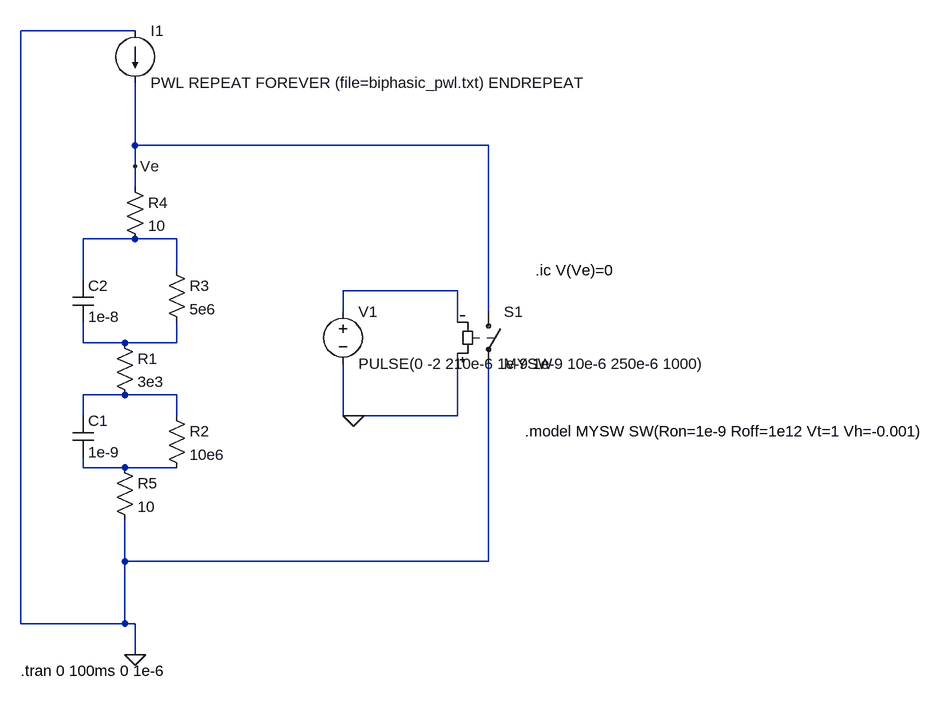
[diagram p0: schematic biphasic_triphasic_shorting.asc]
biphasic_triphasic_shorting.asc, the LTspice schematic file:
Version 4
SHEET 1 1400 680
WIRE 176 -480 0 -480
WIRE 176 -304 176 -400
WIRE 720 -304 176 -304
WIRE 176 -272 176 -304
WIRE 176 -240 176 -272
WIRE 176 -160 96 -160
WIRE 240 -160 176 -160
WIRE 240 -112 240 -160
WIRE 96 -96 96 -160
WIRE 672 -80 496 -80
WIRE 496 -48 496 -80
WIRE 720 -48 720 -304
WIRE 672 -32 672 -80
WIRE 96 0 96 -32
WIRE 160 0 96 0
WIRE 240 0 240 -32
WIRE 240 0 160 0
WIRE 160 80 96 80
WIRE 240 80 160 80
WIRE 96 112 96 80
WIRE 240 112 240 80
WIRE 496 112 496 32
WIRE 512 112 496 112
WIRE 672 112 672 16
WIRE 672 112 512 112
WIRE 96 192 96 176
WIRE 160 192 96 192
WIRE 240 192 160 192
WIRE 160 336 160 272
WIRE 720 336 720 32
WIRE 720 336 160 336
WIRE 0 432 0 -480
WIRE 160 432 160 336
WIRE 160 432 0 432
WIRE 176 432 160 432
WIRE 176 480 176 432
FLAG 176 480 0
FLAG 176 -272 Ve
FLAG 512 112 0
SYMBOL cap 80 112 R0
SYMATTR InstName C1
SYMATTR Value 1e-9
SYMBOL cap 80 -96 R0
SYMATTR InstName C2
SYMATTR Value 1e-8
SYMBOL res 144 -16 R0
SYMATTR InstName R1
SYMATTR Value 3e3
SYMBOL res 224 96 R0
SYMATTR InstName R2
SYMATTR Value 10e6
SYMBOL res 224 -128 R0
SYMATTR InstName R3
SYMATTR Value 5e6
SYMBOL res 160 -256 R0
SYMATTR InstName R4
SYMATTR Value 10
SYMATTR SpiceLine tol=1 pwr=1
SYMBOL res 144 176 R0
SYMATTR InstName R5
SYMATTR Value 10
SYMBOL current 176 -480 R0
SYMATTR InstName I1
SYMATTR Value PWL REPEAT FOREVER (file=biphasic_pwl.txt) ENDREPEAT
SYMBOL sw 720 -64 R0
SYMATTR InstName S1
SYMATTR Value MYSW
SYMBOL voltage 496 -64 R0
WINDOW 123 0 0 Left 2
WINDOW 39 0 0 Left 2
SYMATTR InstName V1
SYMATTR Value PULSE(0 -2 210e-6 1e-9 1e-9 10e-6 250e-6 1000)
TEXT 0 504 Left 2 !.tran 0 100ms 0 1e-6
TEXT 792 -112 Left 2 !.ic V(Ve)=0
TEXT 776 136 Left 2 !.model MYSW SW(Ron=1e-9 Roff=1e12 Vt=1 Vh=-0.001)

The netlist it stands for:
* biphasic_triphasic_shorting.asc
C1 N004 N005 1e-9
C2 N001 N003 1e-8
R1 N003 N004 3e3
R2 N004 N005 10e6
R3 N001 N003 5e6
R4 Ve N001 10 tol=1 pwr=1
R5 N005 0 10
I1 0 Ve PWL REPEAT FOREVER (file=biphasic_pwl.txt) ENDREPEAT
S1 Ve 0 0 N002 MYSW
V1 N002 0 PULSE(0 -2 210e-6 1e-9 1e-9 10e-6 250e-6 1000)
.tran 0 100ms 0 1e-6
.ic V(Ve)=0
.model MYSW SW(Ron=1e-9 Roff=1e12 Vt=1 Vh=-0.001)
.backanno
.end